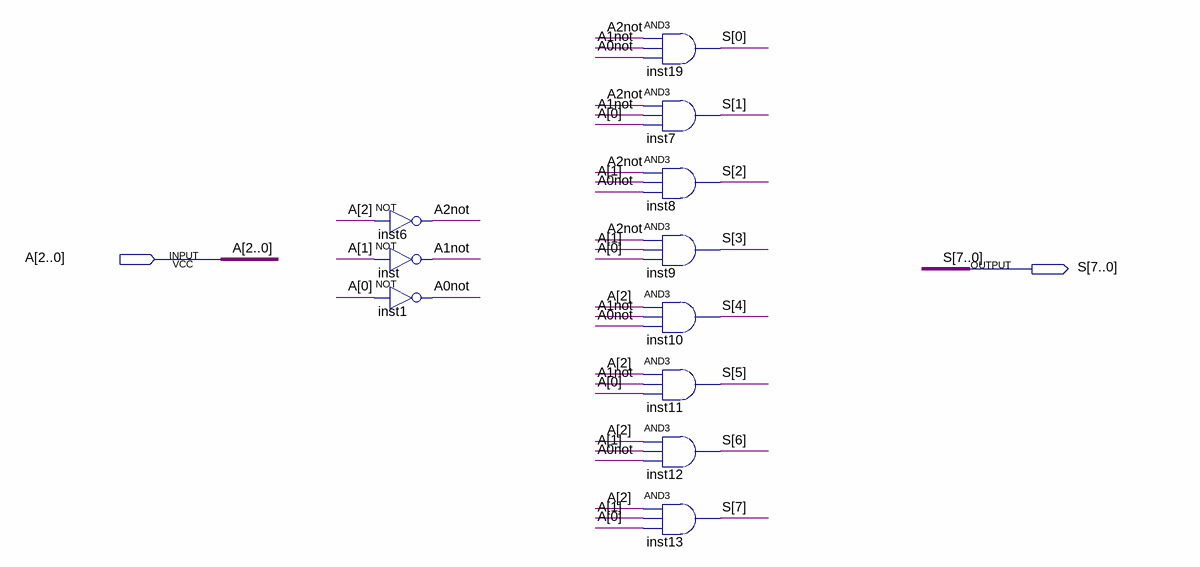
[diagram p0: schematic sheet]
// Quartus schematic 3_to_8_decoder.bdf as structural Verilog: 11 symbols, 2 pins
module \3_to_8_decoder  (
  input  [2:0] A,
  output [7:0] S
);

  wire A0not, A1not, A2not;

  not inst6 (A2not, A[2]);
  not inst (A1not, A[1]);
  not inst1 (A0not, A[0]);
  and inst19 (S[0], A2not, A1not, A0not);
  and inst7 (S[1], A2not, A1not, A[0]);
  and inst8 (S[2], A2not, A[1], A0not);
  and inst9 (S[3], A2not, A[1], A[0]);
  and inst10 (S[4], A[2], A1not, A0not);
  and inst11 (S[5], A[2], A1not, A[0]);
  and inst12 (S[6], A[2], A[1], A0not);
  and inst13 (S[7], A[2], A[1], A[0]);
endmodule
